# Altium schematic sheet Schematic.SchDoc
size A
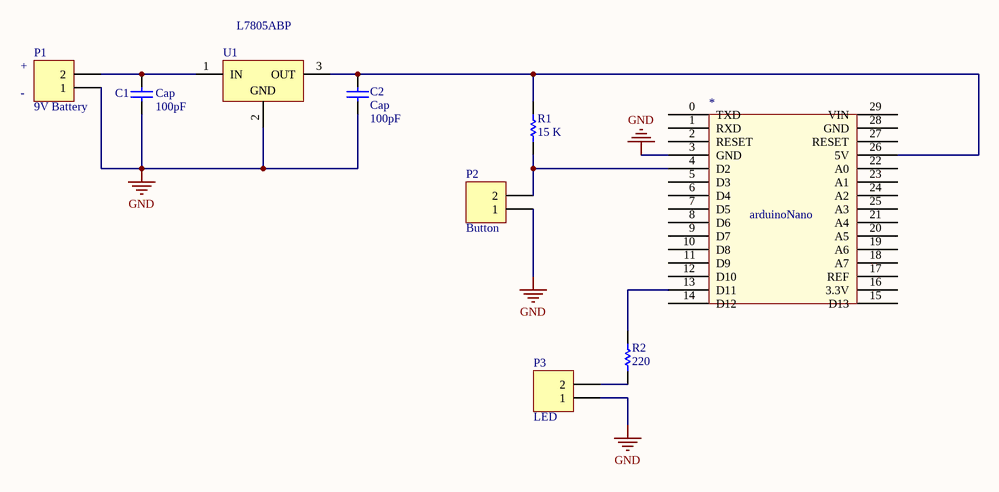
[diagram p0: Schematic.SchDoc]

## Parts
*  arduinoNano  [Arduino nano]
C1  Cap  value 100pF  [RAD-0.3]
C2  Cap  value 100pF  [RAD-0.3]
P1  9V Battery  [HDR1X2]
P2  Button  [HDR1X2]
P3  LED  [HDR1X2]
R1  15 K  [YFDZ-MFJRY13-2_M]
R2  220  [YFDZ-MFJRY13-2_M]
U1  L7805ABP  [TO220FP]

## Nets
GND: *.3(GND) C1.2 C2.1 P1.1 P2.1 P3.1 U1.2(GND)
Net*_4: *.4(D2) P2.2 R1.1
Net*_13: *.13(D11) R2.2
Net*_26: *.26(5V) C2.2 R1.2 U1.3(OUT)
NetC1_1: C1.1 P1.2 U1.1(IN)
NetP3_2: P3.2 R2.1

Not connected (* = marked no-connect by the designer): * 0(TXD) 1(RXD) 2(RESET) 5(D3) 6(D4) 7(D5) 8(D6) 9(D7) 10(D8) 11(D9) 12(D10) 14(D12) 15(D13) 16(3.3V) 17(REF) 18(A7) 19(A6) 20(A5) 21(A4) 22(A0) 23(A1) 24(A2) 25(A3) 27(RESET) 28(GND) 29(VIN)

## Notes on the sheet
- (near P1) +
- (near P1) -

## Library data of the parts
C1 C2 = Cap: Capacitor; Published: 8-Jun-2000; LatestRevisionDate: 17-Jul-2002; LatestRevisionNote: Re-released for DXP Platform.; PackageReference: RAD-0.3; Publisher: Altium Limited; PackageDescription: Radial Cap, Thru-Hole; 2 Leads; 0.3 in Pin Spacing
P1-P3 = Header 2: Header, 2-Pin; LatestRevisionDate: 17-Jul-2002; LatestRevisionNote: Re-released for DXP Platform.; Publisher: Altium Limited
R1 R2 = CMP-0923-00002-1: Metal Film Fixed Resistor, 51 KOhm +/- 5%, -55 to 155 degC, 2-Pin THD, Dia 1.7 mm, Body Length 3.2 mm, RoHS; PartNumber: MFJRY13T52051K00; Manufacturer: YingFa Electronics; Pulsed Voltage (Max.) (V): 300; Operating Voltage (Max.) (V): 150; Accuracy: +/- 5%; Resistance (Ohm): 51000; Insulation Voltage (Max.) (V): 200; Temperature Range: -55 to 155 degC; ComponentLink2Description: Datasheet; PackageReference: MFJRY13-2; RoHS: TRUE; Load Voltage (Max.) (V): 300; Mounting Technology: Through Hole; ComponentLink1Description: Manufacturer URL; PackageDescription: 2-Pin Through Hole Resistor, Dia 1.7 mm, Body Length 3.2 mm; ComponentLink2URL: http://www.szyfdz.net/mojinshuyanghuamodianzu/; ComponentLink1URL: http://www.szyfdz.net/
U1 = CMP-0244-00479-1: Positive Voltage Regulator, 5V, 3-Pin TO-220FP; DatasheetVersion: 16/11/2011; PackageReference: TO220FP; ComponentLink1URL: http://www.st.com; PackageDescription: TO, Thru-Hole, Vertical, Heatsink Mounted; 3 In-Line Leads; Pitch 2.54 mm; ComponentLink2Description: Datasheet; PackageVersion: 2011; ComponentLink1Description: Manufacturer URL; ComponentLink2URL: http://www.st.com/internet/com/TECHNICAL_RESOURCES/TECHNICAL_LITERATURE/DATASHEET/CD00000444.pdf